# Altium schematic sheet UART.SchDoc
size A4; SheetNumber: 3; SheetTotal: 5; SPICEModelCacheEFDJEFTA: <root> / <DocumentId>EFDJEFTA</DocumentId> / <CacheFrame Number="0"> / <Model Name="0603_885012106005_4.7uf" Kind="CKT"> / <Text>******* / .subckt 0603_885012106005_4.7uF 1 2 / Rser 1 3 0.00436564105168 / Lser 2 4 5.20484374E-10 / C1 3 4 0.0000047 / Rpar 3 4 10000000 / .ends 0603_885012106005_4.7uF</Text> / </Model> / </CacheFrame> / </root>
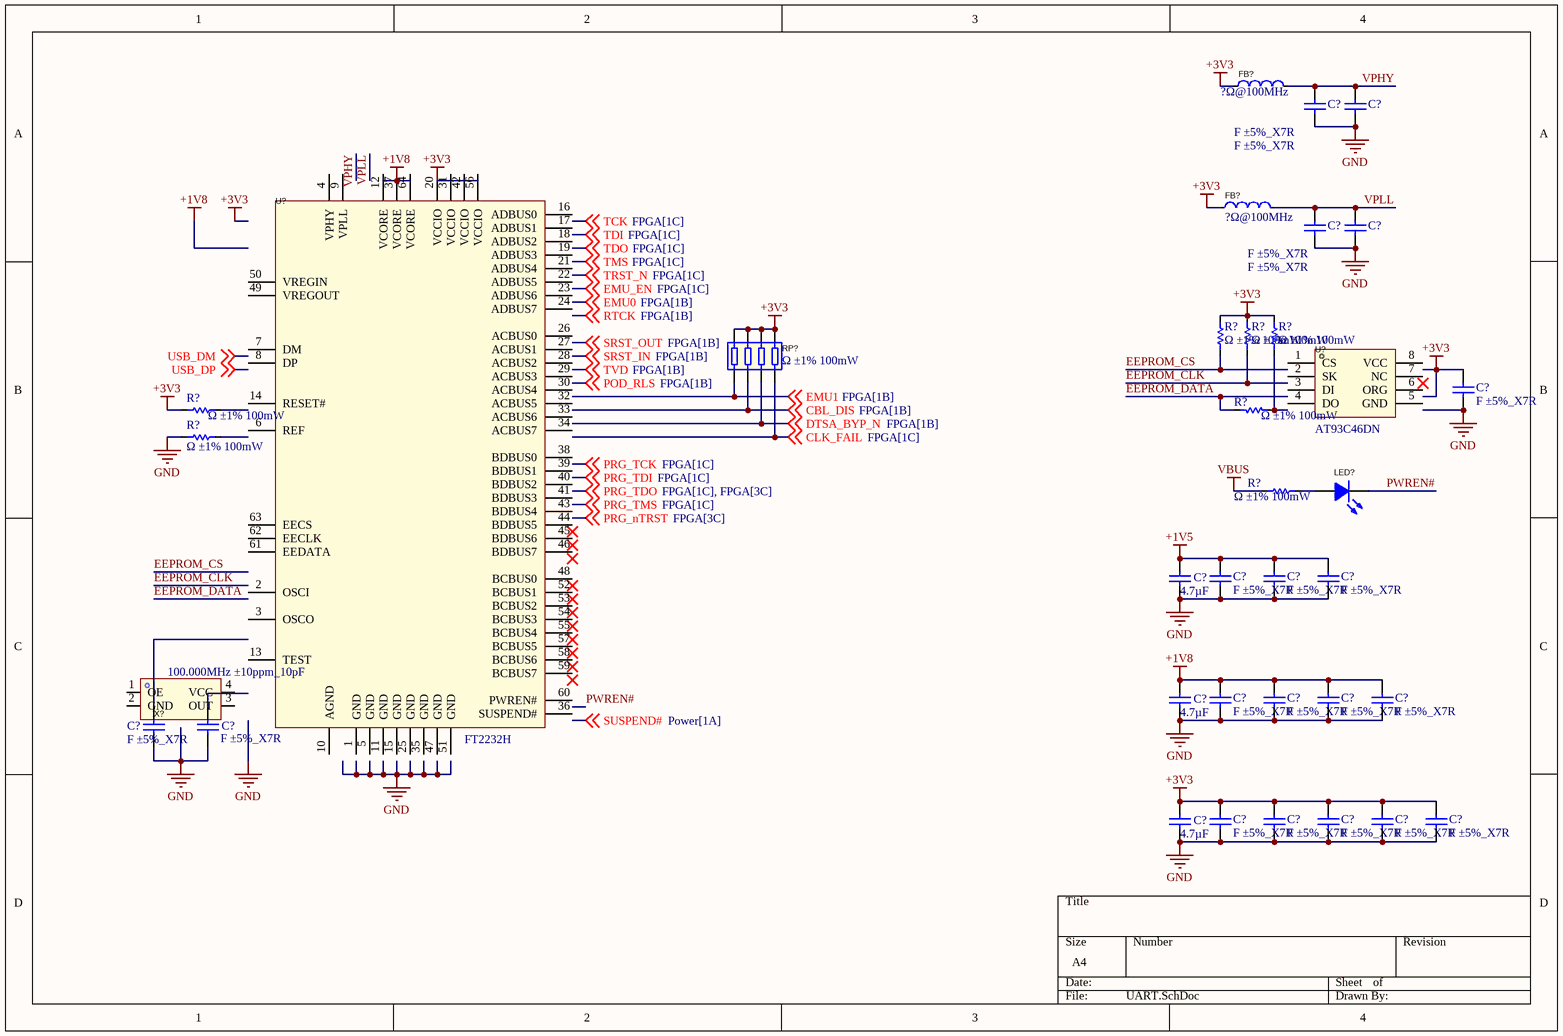
[diagram p0: UART.SchDoc]

## Parts
(Parts that share a designator on the sheet are numbered #1, #2 ... from top to bottom, then left to right.)
C?#1  F ±5%_X7R  [C0805]
C?#2  F ±5%_X7R  [C0805]
C?#3  F ±5%_X7R  [C0805]
C?#4  F ±5%_X7R  [C0805]
C?#5  F ±5%_X7R  [C0805]
C?#6  F ±5%_X7R  [C0805]
C?#7  F ±5%_X7R  [C0805]
C?#8  F ±5%_X7R  [C0805]
C?#9  4.7µF  [WCAP-CSGP_0603_L1.6W0.8H0.8_Reflow]
C?#10  F ±5%_X7R  [C0805]
C?#11  F ±5%_X7R  [C0805]
C?#12  F ±5%_X7R  [C0805]
C?#13  F ±5%_X7R  [C0805]
C?#14  4.7µF  [WCAP-CSGP_0603_L1.6W0.8H0.8_Reflow]
C?#15  F ±5%_X7R  [C0805]
C?#16  F ±5%_X7R  [C0805]
C?#17  F ±5%_X7R  [C0805]
C?#18  F ±5%_X7R  [C0805]
C?#19  F ±5%_X7R  [C0805]
C?#20  F ±5%_X7R  [C0805]
C?#21  F ±5%_X7R  [C0805]
C?#22  4.7µF  [WCAP-CSGP_0603_L1.6W0.8H0.8_Reflow]
FB?#1  ?Ω@100MHz  [L0603]
FB?#2  ?Ω@100MHz  [L0603]
LED?  LED  [LED0603-RD]  (value not drawn)
R?#1  Ω ±1% 100mW  [R0603]
R?#2  Ω ±1% 100mW  [R0603]
R?#3  Ω ±1% 100mW  [R0603]
R?#4  Ω ±1% 100mW  [R0603]
R?#5  Ω ±1% 100mW  [R0603]
R?#6  Ω ±1% 100mW  [R0603]
R?#7  Ω ±1% 100mW  [R0603]
RP?  Ω ±1% 100mW  [RES-ARRAY-SMD_0402-8P-L2.0-W1.0-BL]
U?#1  AT93C46DN  [SOIC-8_L4.9-W3.9-P1.27-LS6.0-BL]
U?#2  FT2232H  [LQFP-64_L10.0-W10.0-P0.50-LS12.0-TL]
X?  100.000MHz ±10ppm_10pF  [OSC-SMD_4P-L3.2-W2.5-BL_SIT8008BI]

## Nets
+1V5: C?#6.2 C?#7.2 C?#8.2 C?#9.2
+1V8: C?#10.2 C?#11.2 C?#12.2 C?#13.2 C?#14.2
+3V3: C?#5.2 C?#17.2 C?#18.2 C?#19.2 C?#20.2 C?#21.2 C?#22.2 FB?#1.1 FB?#2.2 R?#1.2 R?#2.2 R?#3.2 R?#5.2 RP?.5 RP?.6 RP?.7 RP?.8
GND: C?#1.1 C?#2.1 C?#3.1 C?#4.1 C?#5.1 C?#6.1 C?#7.1 C?#8.1 C?#9.1 C?#10.1 C?#11.1 C?#12.1 C?#13.1 C?#14.1 C?#15.1 C?#16.1 C?#17.1 C?#18.1 C?#19.1 C?#20.1 C?#21.1 C?#22.1 R?#6.2
VBUS: R?#7.1
CBL_DIS: RP?.2 ; off-sheet CBL_DIS
CLK_FAIL: RP?.4 ; off-sheet CLK_FAIL
DTSA_BYP_N: RP?.3 ; off-sheet DTSA_BYP_N
EEPROM_CLK: R?#2.1
EEPROM_CS: R?#1.1
EEPROM_DATA: R?#4.2
EMU1: RP?.1 ; off-sheet EMU1
PWREN#: LED?.2(K)
VPHY: C?#1.2 C?#2.2 FB?#1.2
VPLL: C?#3.2 C?#4.2 FB?#2.1
NetLED?_1: LED?.1(A) R?#7.2
NetR?#3_1: R?#3.1 R?#4.1

Not connected (* = marked no-connect by the designer): C?#15 2; C?#16 2; R?#5 1; R?#6 1; U?#1 1(CS) 2(SK) 3(DI) 4(DO) 5(GND) 6(ORG) 7(NC) 8(VCC); U?#2 1(GND) 2(OSCI) 3(OSCO) 4(VPHY) 5(GND) 6(REF) 7(DM) 8(DP) 9(VPLL) 10(AGND) 11(GND) 12(VCORE) 13(TEST) 14(RESET#) 15(GND) 16(ADBUS0) 17(ADBUS1) 18(ADBUS2) 19(ADBUS3) 20(VCCIO) 21(ADBUS4) 22(ADBUS5) 23(ADBUS6) 24(ADBUS7) 25(GND) 26(ACBUS0) 27(ACBUS1) 28(ACBUS2) 29(ACBUS3) 30(ACBUS4) 31(VCCIO) 32(ACBUS5) 33(ACBUS6) 34(ACBUS7) 35(GND) 36(SUSPEND#) 37(VCORE) 38(BDBUS0) 39(BDBUS1) 40(BDBUS2) 41(BDBUS3) 42(VCCIO) 43(BDBUS4) 44(BDBUS5) 45(BDBUS6) 46(BDBUS7) 47(GND) 48(BCBUS0) 49(VREGOUT) 50(VREGIN) 51(GND) 52(BCBUS1) 53(BCBUS2) 54(BCBUS3) 55(BCBUS4) 56(VCCIO) 57(BCBUS5) 58(BCBUS6) 59(BCBUS7) 60(PWREN#) 61(EEDATA) 62(EECLK) 63(EECS) 64(VCORE); X? 1(OE) 2(GND) 3(OUT) 4(VCC)

## Library data of the parts
C?#1-C?#8 C?#10-C?#13 C?#15-C?#21 = Cap: Capacitor; Published: 8-Jun-2000; LatestRevisionDate: 17-Jul-2002; LatestRevisionNote: Re-released for DXP Platform.; PackageReference: RAD-0.3; Publisher: Altium Limited; PackageDescription: Radial Cap, Thru-Hole; 2 Leads; 0.3 in Pin Spacing
C?#9 C?#14 C?#22 = 885012106005: WCAP-CSGP Multilayer Ceramic Chip Capacitor, General Purpose, size 0603, X5R, 4.7µF, 6.3VDC; Manufacturer: Wurth Elektronik; Case/Size Code: 0603; Capacitance Tolerance: +/-20%; Dissipation Factor: 10%; Insulation Resistance: 0.02GΩ; Rated Voltage (DC): 6.3V; Technical Reference: X5R0603475M6R3DFCT10000; Manufacturer Part Number: 885012106005; Category: Multilayer Ceramic Chip Capacitors; Match Code: WCAP-CSGP; ComponentLink1Description: Website Link; ComponentLink1URL: https://www.we-online.com/redexpert/article/885012106005?ad; ComponentLink2Description: Datasheet Link; ComponentLink2URL: https://www.we-online.com/redexpert/spec/885012106005?ad; Mount: Surface Mount; Operating Temperature Max: 85°C; Operating Temperature Min: -55°C; Packaging: Tape and Reel; Length: 1.6mm; Width: 0.8mm; Height: 0.8mm; Capacitance: 4.7µF; Ceramic Type: X5R
FB?#1 FB?#2 = Ferrite Bead: 标称阻抗@测试频率:600Ω@100MHz;误差:±25%;直流电阻(RDC):250mΩ;额定电流:2A; Manufacturer: FH(风华); Name: CBW321609U601T; Add into BOM: yes; Tolerance: ±25%; DC Resistance: 250mΩ; Current Rating: 2A; Circuits: 1; Symbol: CBW321609U601T; Device: CBW321609U601T; LCSC Part Name: 600Ω@100MHz ±25%; Supplier Part: C73732; Manufacturer Part: CBW321609U601T; Supplier Footprint: SMD; JLCPCB Part Class: Extended Part; Datasheet: https://atta.szlcsc.com/upload/public/pdf/source/20160606/1465200211209.pdf; Supplier: LCSC; Convert to PCB: yes; Impedance @ Frequency: 600Ω@100MHz
LED? = LED: 发光颜色:; Manufacturer: EVERLIGHT(亿光); Name: 17-21SURC/S530-A2/TR8; Add into BOM: yes; Emitted Color: 红灯; Symbol: 17-21SURC/S530-A2/TR8; Device: 17-21SURC/S530-A2/TR8; LCSC Part Name: 红灯; Supplier Part: C131244; Manufacturer Part: 17-21SURC/S530-A2/TR8; Supplier Footprint: 0805; JLCPCB Part Class: Extended Part; Datasheet: https://atta.szlcsc.com/upload/public/pdf/source/20170918/C131244_1505726880590976254.pdf; Supplier: LCSC; Convert to PCB: yes
R?#1-R?#7 = Res: Resistor; Published: 8-Jun-2000; LatestRevisionDate: 17-Jul-2002; LatestRevisionNote: Re-released for DXP Platform.; PackageReference: AXIAL-0.3; Publisher: Altium Limited; PackageDescription: Axial Device, Thru-Hole; 2 Leads; 0.3 in Pin Spacing
RP? = RP: Manufacturer: YAGEO(国巨); Name: 30Ω; Symbol: YC124-JR-0730RL; Add into BOM: yes; Value: 30Ω; Tolerance: ±5%; Power(Watts): 62.5mW; Number of Resistors: 4; Temperature Coefficient: ±200ppm/℃; Device: YC124-JR-0730RL; LCSC Part Name: 30Ω ±5% 0402x4; Supplier Part: C136847; Manufacturer Part: YC124-JR-0730RL; Supplier Footprint: 0402x4; JLCPCB Part Class: Extended Part; Datasheet: https://atta.szlcsc.com/upload/public/pdf/source/20171116/C136847_15108221195481123713.pdf; Supplier: LCSC; Convert to PCB: yes; Number of Pins: 8
U?#1 = AT93C46DN: Manufacturer: MICROCHIP(美国微芯); Name: AT93C46DN-SH-T; Add into BOM: yes; Interface Type: SPI; Memory Size: 1Kbit; Supply Voltage: 1.8V~5.5V; Symbol: AT93C46DN-SH-T; Device: AT93C46DN-SH-T; LCSC Part Name: AT93C46DN-SH-T; Supplier Part: C6499; Manufacturer Part: AT93C46DN-SH-T; Supplier Footprint: SOP-8; JLCPCB Part Class: Extended Part; Datasheet: https://atta.szlcsc.com/upload/public/pdf/source/20210201/C6499_C0D2958C2C3F034123F82B64259CD392.pdf; Supplier: LCSC; Convert to PCB: yes; Operating Temperature: -40℃~+85℃
U?#2 = FT2232H: Manufacturer: FTDI(飞特帝亚); Name: FT2232HL-REEL; Symbol: FT2232HL; Add into BOM: yes; Device: FT2232HL-REEL; LCSC Part Name: FT2232HL-REEL; Supplier Part: C27882; Manufacturer Part: FT2232HL-REEL; Supplier Footprint: LQFP-64(10x10); JLCPCB Part Class: Extended Part; Datasheet: https://atta.szlcsc.com/upload/public/pdf/source/20140319/1457707024994.pdf; Supplier: LCSC; Convert to PCB: yes; Type: -; Protocol: -; Number of Drivers/Receivers: -; Data Rate: -; Supply Voltage: -
X? = oscillator: Manufacturer: EPSON(爱普生); Frequency Stability: ±20ppm; Name: 100MHz; Symbol: SG-8101CE-100.000000MHZ-TCHPA; Device: SG-8101CE 100.000000MHz TCHPA; Add into BOM: yes; Value: 100MHz; Supply Voltage: 1.8V~3.3V; Operating Temperature: -40℃~+105℃; LCSC Part Name: 3225 100MHz 1.8~3.3V 20ppm  OE  SMD_4P -40~+105℃; Supplier Part: C390559; Manufacturer Part: SG-8101CE 100.000000MHz TCHPA; Supplier Footprint: SMD3225-4P; JLCPCB Part Class: Extended Part; Datasheet: https://atta.szlcsc.com/upload/public/pdf/source/20190626/C390559_D0305530A2A3721045533DB4F9788766.pdf; Supplier: LCSC; Convert to PCB: yes